# EAGLE design Qwiic_Accelerometer_LIS2DH12 (EAGLE 9.4.2)
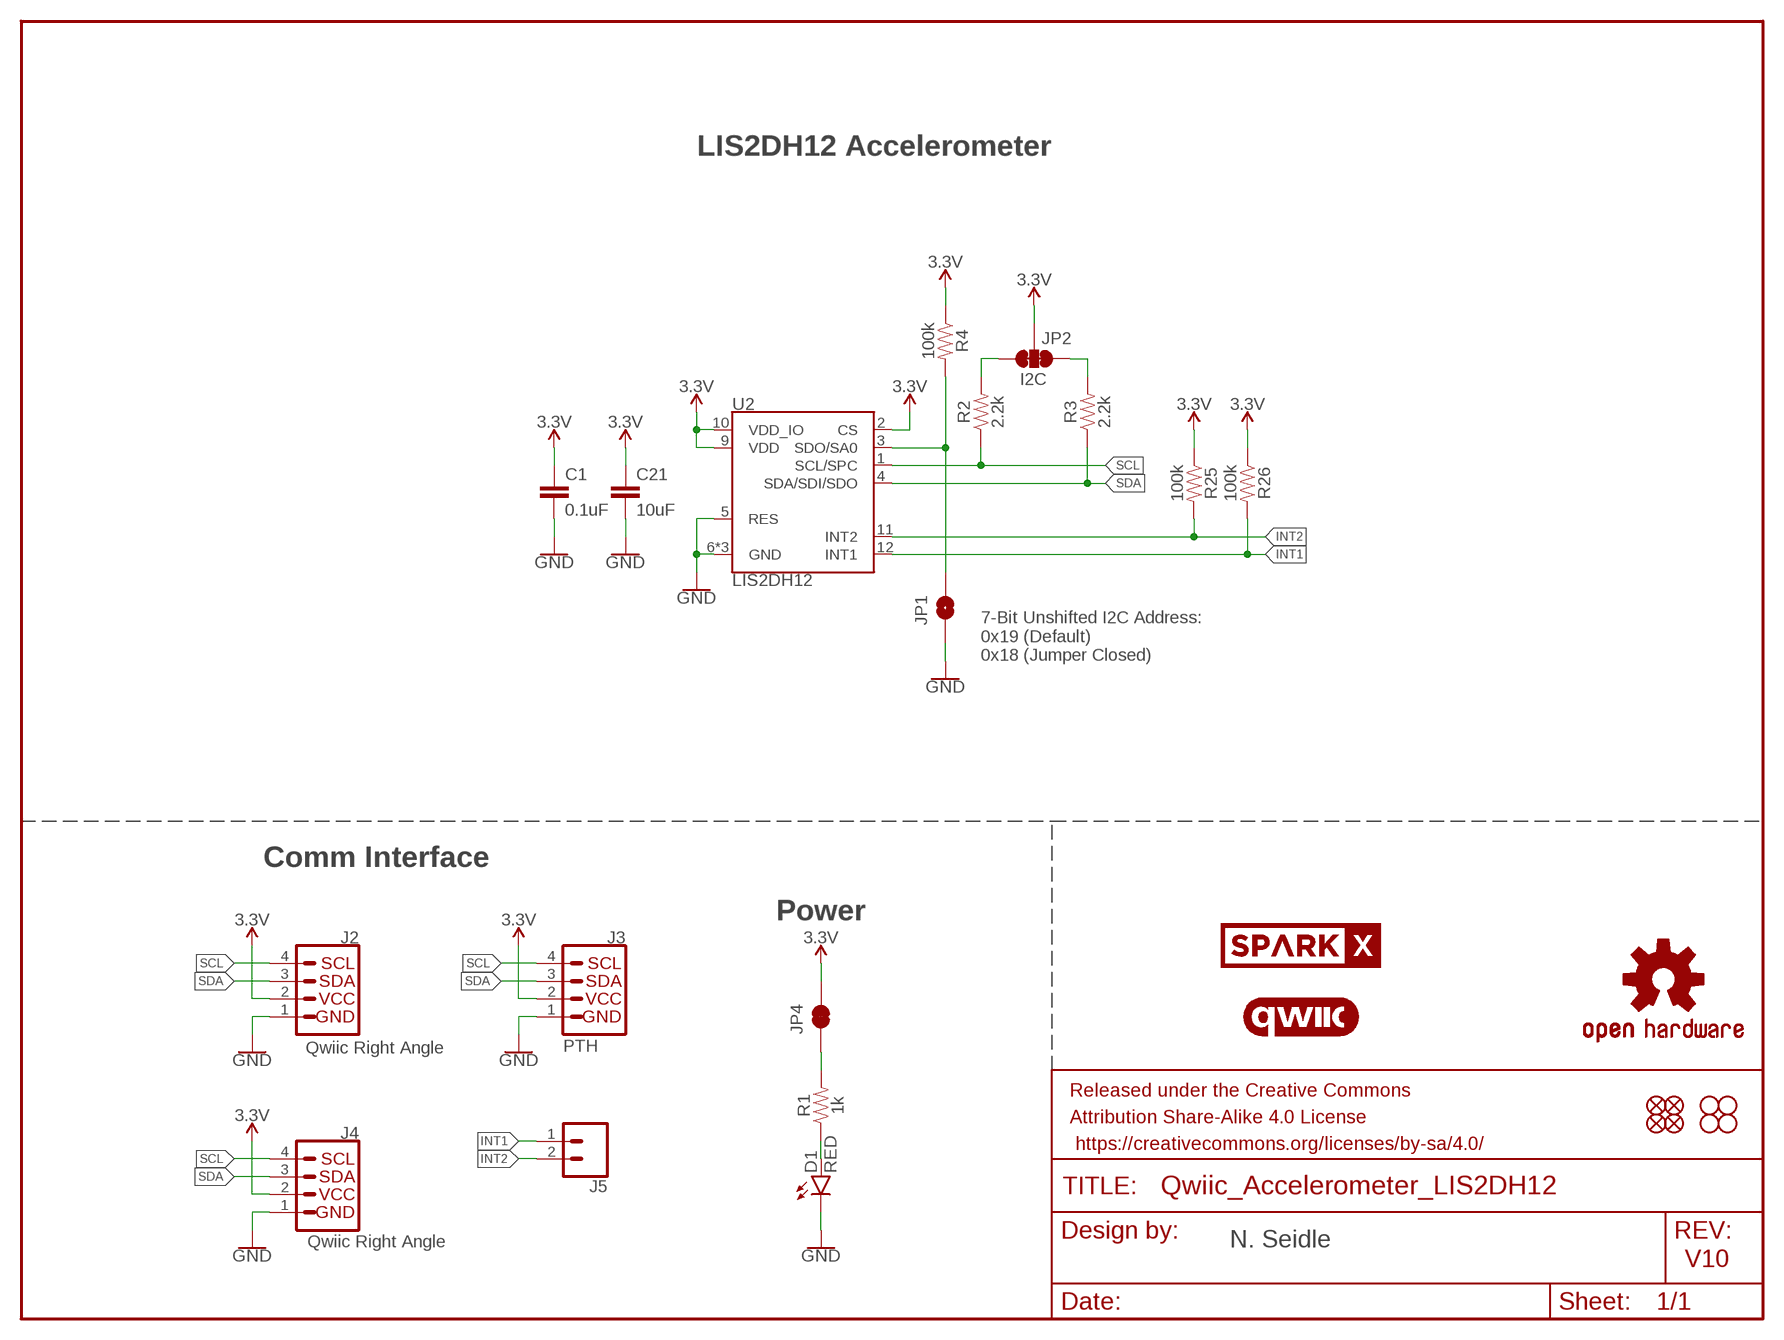
[diagram p0: schematic, sheet 1]

## Parts
C1  0.1uF  0.1UF-0603-25V-(+80/-20%)  [0603]
C21  10uF  10UF-0603-6.3V-20%  [0603]
D1  RED  LED-RED0603  [LED-0603]
FD1  FIDUCIALUFIDUCIAL  [FIDUCIAL-MICRO]
FD2  FIDUCIALUFIDUCIAL  [FIDUCIAL-MICRO]
FD3  FIDUCIALUFIDUCIAL  [FIDUCIAL-MICRO]
FD4  FIDUCIALUFIDUCIAL  [FIDUCIAL-MICRO]
FRAME1  FRAME-LETTER  [CREATIVE_COMMONS]
H1  STAND-OFF  [STAND-OFF]
H2  STAND-OFF  [STAND-OFF]
H3  STAND-OFF  [STAND-OFF]
H4  STAND-OFF  [STAND-OFF]
J2  Qwiic Right Angle  I2C_STANDARDQWIIC  [JST04_1MM_RA]
J3  PTH  I2C_STANDARD_NO_SILK  [1X04_NO_SILK]
J4  Qwiic Right Angle  I2C_STANDARDQWIIC  [JST04_1MM_RA]
J5  CONN_021X02_NO_SILK  [1X02_NO_SILK]
JP1  JUMPER-SMT_2_NO_SILK  [SMT-JUMPER_2_NO_SILK]
JP2  I2C  JUMPER-SMT_3_2-NC_TRACE_SILK  [SMT-JUMPER_3_2-NC_TRACE_SILK]
JP4  JUMPER-SMT_2_NC_TRACE_SILK  [SMT-JUMPER_2_NC_TRACE_SILK]
LOGO1  OSHW-LOGOMINI  [OSHW-LOGO-MINI]
LOGO4  QWIIC_LOGO_CONNECTOR  [QWIIC_5.5MM]
R1  1k  1KOHM-0603-1/10W-1%  [0603]
R2  2.2k  2.2KOHM-0603-1/10W-1%  [0603]
R3  2.2k  2.2KOHM-0603-1/10W-1%  [0603]
R4  100k  100KOHM-0603-1/10W-1%  [0603]
R25  100k  100KOHM-0603-1/10W-1%  [0603]
R26  100k  100KOHM-0603-1/10W-1%  [0603]
U2  LIS2DH12  [LGA-12-LISDH12]
U$30  SPARKX-LOGO4  [SPARKX-MEDIUM]

## Nets
3.3V: C1.1 C21.1 J2.2 J3.2 J4.2 JP2.2 JP4.2 R4.1 R25.1 R26.1 U2.2(CS) U2.9(VDD) U2.10(VDD_IO)
GND: C1.2 C21.2 D1.C J2.1 J3.1 J4.1 JP1.1 U2.5(RES) U2.6(GND) U2.7(GND) U2.8(GND)
INT1: J5.1 R26.2 U2.12(INT1)
INT2: J5.2 R25.2 U2.11(INT2)
N$1: JP4.1 R1.2
N$2: JP2.1 R3.2
N$3: JP2.3 R2.2
N$4: JP1.2 R4.2 U2.3(SDO/SA0)
N$10: D1.A R1.1
SCL: J2.4 J3.4 J4.4 R2.1 U2.1(SCL/SPC)
SDA: J2.3 J3.3 J4.3 R3.1 U2.4(SDA/SDI/SDO)

## Notes on the sheet
- LIS2DH12 Accelerometer
- 7-Bit Unshifted I2C Address:
  0x19 (Default)
  0x18 (Jumper Closed)
- Comm Interface
- Power
- N. Seidle
- V10

## Library data of the parts
C1 = SparkFun-Capacitors:0.1UF: 0.1µF ceramic capacitors A capacitor is a passive two-terminal electrical component used to store electrical energy temporarily in an electric field.; PROD_ID: CAP-00810
C21 = SparkFun-Capacitors:10UF: 10.0µF ceramic capacitors A capacitor is a passive two-terminal electrical component used to store electrical energy temporarily in an electric field.; PROD_ID: CAP-11015
D1 = SparkFun-LED:LED-RED: Red SMD LED Used in manufacturing of most products at SparkFun Packages: 0603 - SMD 0603 package [Product Link] <http://docs.avagotech.com/docs/AV02-0551EN> 0603 SMART - SMD 0603 SMART package ( more efficient and expensive)[Product Link] <http://www.osram-os.com/Graphics/XPic2/00077099_0.pdf> 1206 - SMD1206 package [Product Link] <https://www.sparkfun.com/datasheets/DevTools/LilyPad/Q150OVS4.pdff> SparkFun Products: Pro Mini 328 -5V <https://www.sparkfun.com/products/821> RedBoard <https://www.sparkfun.com/products/12757> IOIO-OTG <https://www.sparkfun.com/products/13613>; PROD_ID: DIO-00819
FD1-FD4 = SparkFun-Aesthetics:FIDUCIAL: Fiducial Alignment Points Point-of-reference for pick-and-place machines and other optical instruments.
FRAME1 = SparkFun-Aesthetics:FRAME-LETTER: Schematic Frame - Letter Standard 8.5x11 US Letter frame
H1-H4 = SparkFun-Hardware:STAND-OFF: Stand Off Drill holes for mechanically mounting via screws, standoffs, etc. Note: Use the keepout ring to avoid running the screw head into surrounding components. Variant Overviews STAND-OFF - Mechanical footprint for a #4 phillips button head screw. STAND-OFF-TIGHT - Mechanical footprint for a #4 phillips button head screw, Example SparkFun Products Screw - Phillips Head (1/4", 4-40, 10 pack) <https://www.sparkfun.com/products/10453> (PRT-10453) Screw - Phillips Head (1/2", 4-40, 10 pack) <https://www.sparkfun.com/products/10452> (PRT-10452) Screw - Phillips Head (3/4", 4-40, 10 pack) <https://www.sparkfun.com/products/10451> (PRT-10451) Screw - Phillips Head (1", 4-40, 10 pack) <https://www.sparkfun.com/products/10450> (PRT-10450)
J2 J4 = SparkFun-Connectors:I2C_STANDARD: SparkFun I2C Standard Pinout Header SparkFun has standardized on a pinout for all I2C based sensor breakouts. This pinout allows I2C boards to be plugged directly into the headers on Arduino Uno compatible boards, and to be daisy chained easily. Example SparkFun Products: SparkFun Atmospheric Sensor Breakout - BME280 <https://www.sparkfun.com/products/13676> SparkFun Altitude/Pressure Sensor Breakout - MPL3115A2 <https://www.sparkfun.com/products/11084> SparkFun TOF Range Finder Sensor - VL6180 <https://www.sparkfun.com/products/12785>; PROD_ID: CONN-13694
J3 = SparkFun-Connectors:I2C_STANDARD: SparkFun I2C Standard Pinout Header SparkFun has standardized on a pinout for all I2C based sensor breakouts. This pinout allows I2C boards to be plugged directly into the headers on Arduino Uno compatible boards, and to be daisy chained easily. Example SparkFun Products: SparkFun Atmospheric Sensor Breakout - BME280 <https://www.sparkfun.com/products/13676> SparkFun Altitude/Pressure Sensor Breakout - MPL3115A2 <https://www.sparkfun.com/products/11084> SparkFun TOF Range Finder Sensor - VL6180 <https://www.sparkfun.com/products/12785>
J5 = SparkFun-Connectors:CONN_02: Multi connection point. Often used as Generic Header-pin footprint for 0.1 inch spaced/style header connections On any of the 0.1 inch spaced packages, you can populate with these: Break Away Headers - Straight <https://www.sparkfun.com/products/116> (PRT-00116) Break Away Male Headers - Right Angle <https://www.sparkfun.com/products/553> (PRT-00553) Female Headers <https://www.sparkfun.com/products/115> (PRT-00115) Break Away Headers - Machine Pin <https://www.sparkfun.com/products/117> (PRT-00117) Break Away Female Headers - Swiss Machine Pin <https://www.sparkfun.com/products/743> (PRT-00743) For SCREWTERMINALS and SPRING TERMINALS visit here: Screw Terimnals on SparkFun.com <https://www.sparkfun.com/search/results?term=Screw+Terminals> (5mm/3.5mm/2.54mm spacing) This device is also useful as a general connection point to wire up your design to another part of your project. Our various solder wires solder well into these plated through hole pads. Hook-Up Wire - Assortment (Stranded, 22 AWG) <https://www.sparkfun.com/products/11375> (PRT-11375) Hook-Up Wire - Assortment (Solid Core, 22 AWG) <https://www.sparkfun.com/products/11367> (PRT-11367) View the entire wire category on our website here <https://www.sparkfun.com/categories/141> Special notes: Molex polarized connector foot print use with: PRT-08233 with associated crimp pins and housings. 2.54_SCREWTERM for use with PRT-10571. 3.5mm Screw Terminal footprints for PRT-08084 5mm Screw Terminal footprints for use with PRT-08432
JP1 = SparkFun-Jumpers:JUMPER-SMT_2_NO: Normally open jumper This jumper has two pads in close proximity to each other. Apply solder to close the connection. Round pads are easier to solder for beginners, but are a lot larger. SparkFun Product that uses the round pads: SparkFun EL Sequencer <https://www.sparkfun.com/products/12781>
JP2 = SparkFun-Jumpers:JUMPER-SMT_3_2-NC_TRACE: Normally closed trace jumper (2 of 2 connections) This jumper has a trace between all three pads so they are normally closed (NC). Use a razor knife to open the connection(s). For best results follow the IPC guidelines for cutting traces: Cutout at least 0.063 mm (0.005 in). Remove all loose material to clean up the cut area. Seal the cut with an approved epoxy. Reapply solder to reclose the connection(s).
JP4 = SparkFun-Jumpers:JUMPER-SMT_2_NC_TRACE: Normally closed trace jumper This jumper has a trace between two pads so it's normally closed (NC). Use a razor knife to open the connection. For best results follow the IPC guidelines for cutting traces: Cutout at least 0.063 mm (0.005 in). Remove all loose material to clean up the cut area. Seal the cut with an approved epoxy. Reapply solder to reclose the connection.
LOGO1 = SparkFun-Aesthetics:OSHW-LOGO: Open-Source Hardware (OSHW) Logo This logo indicates the piece of hardware it is found on incorporates a OSHW license and/or adheres to the definition of open source hardware found here: http://freedomdefined.org/OSHW
LOGO4 = SparkFun-Aesthetics:QWIIC_LOGO: Qwiic Logos for placement on schematic and PCB. The 5.5mm silk logo is best for placing next to Qwiic connector.
R1 = SparkFun-Resistors:1KOHM: 1kΩ resistor A resistor is a passive two-terminal electrical component that implements electrical resistance as a circuit element. Resistors act to reduce current flow, and, at the same time, act to lower voltage levels within circuits. - Wikipedia; PROD_ID: RES-07856
R2 R3 = SparkFun-Resistors:2.2KOHM: 2.2kΩ resistor A resistor is a passive two-terminal electrical component that implements electrical resistance as a circuit element. Resistors act to reduce current flow, and, at the same time, act to lower voltage levels within circuits. - Wikipedia; PROD_ID: RES-08272
R4 R25 R26 = SparkFun-Resistors:100KOHM: 100kΩ resistor A resistor is a passive two-terminal electrical component that implements electrical resistance as a circuit element. Resistors act to reduce current flow, and, at the same time, act to lower voltage levels within circuits. - Wikipedia; PROD_ID: RES-07828
U2 = SparkFun-Sensors:LIS2DH12; DIGIKEY: 497-14851-2-ND; PROD_ID: IC-14229
U$30 = SparkX:SPARKX-LOGO

## Board
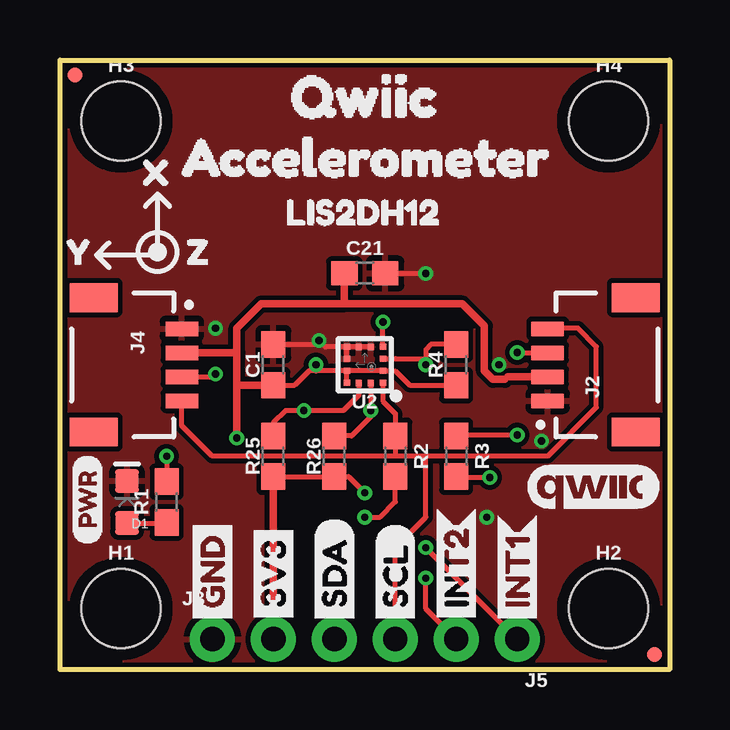
[diagram p1: board, top side]
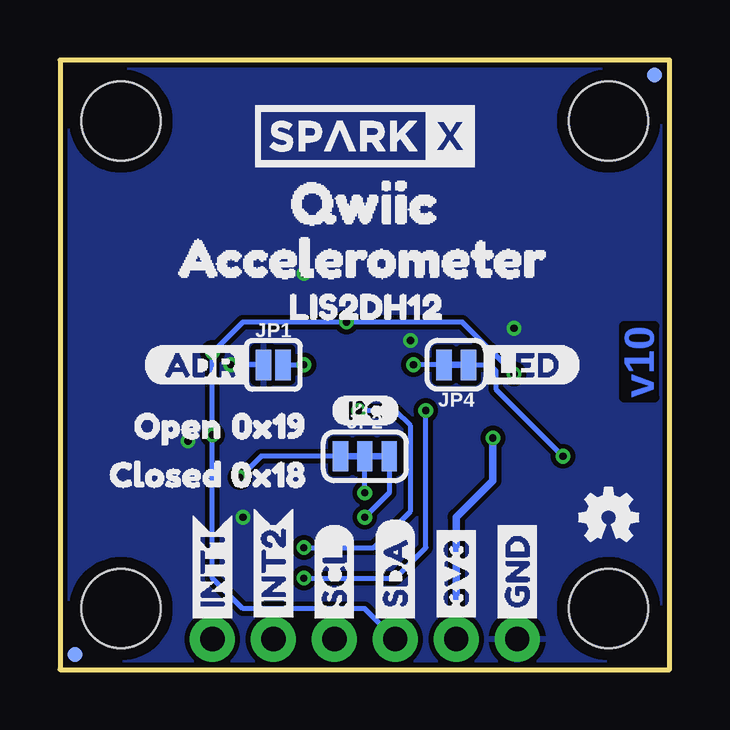
[diagram p2: board, bottom side, seen from below]

Size 25.4 x 25.4 mm. Coordinates in mm from the lower left corner, seen from the top.
Outline: 25.4,0 0,0 0,25.4 25.4,25.4 25.4,0
Copper layers (1*16): Top 0.035mm / dielectric 1.5mm / Bottom 0.035mm
Design rules "SparkFun-2-layer-PCBWay-LIMIT": minimum track width 6mil, minimum drill 0.3mm, track to track 6mil, track to pad 6mil, pad to pad 6mil, via to via 6mil, smd to smd 6mil, copper to edge 6mil, drill to drill 6mil, minimum pad ring 6mil, minimum via ring 6mil, stop-mask expansion 4mil, vias tented up to drill 25mil, thermal gap 10mil

### Footprints (pad centres in the part's own frame; a part is rotated, then mirrored left to right if it is on the bottom)
0603 = smd 1.1 x 1: 1 -0.85,0; 2 0.85,0
LED-0603 = smd 1 x 1: A -0.877,0; C 0.877,0
FIDUCIAL-MICRO = smd 0.635 x 0.635: 1 0,0
STAND-OFF = hole 3.302: 0,0
JST04_1MM_RA = smd 0.6 x 1.35: 1 -1.5,0; 2 -0.5,0; 3 0.5,0; 4 1.5,0 | smd 1.2 x 2: NC1 2.8,-3.675; NC2 -2.8,-3.675
1X04_NO_SILK = drill 1.016 pad 1.88: 1 0,0; 2 2.54,0; 3 5.08,0; 4 7.62,0
1X02_NO_SILK = drill 1.016 pad 1.88: 1 0,0; 2 2.54,0
SMT-JUMPER_2_NO_SILK = smd 0.635 x 1.27: 1 -0.406,0; 2 0.406,0
SMT-JUMPER_3_2-NC_TRACE_SILK = smd 0.635 x 1.27: 1 -1.016,0; 2 0,0; 3 1.016,0
SMT-JUMPER_2_NC_TRACE_SILK = smd 0.635 x 1.27: 1 -0.508,0; 2 0.508,0
LGA-12-LISDH12 = smd 0.275 x 0.25: 1 -0.75,0.75; 2 -0.75,0.25; 3 -0.75,-0.25; 4 -0.75,-0.75; 7 0.75,-0.75; 8 0.75,-0.25; 9 0.75,0.25; 10 0.75,0.75 | smd 0.25 x 0.275: 5 -0.25,-0.75; 6 0.25,-0.75; 11 0.25,0.75; 12 -0.25,0.75

### Placement (x,y rotation side)
C1  8.89,12.7 90 top
C21  12.7,16.51 0 top
D1  2.79,6.99 90 top
FD1  0.64,24.77 0 top
FD2  24.77,0.64 0 top
FD3  24.77,0.64 0 bottom
FD4  0.64,24.77 0 bottom
FRAME1  -17.78,-17.78 0 top  (outside the outline)
H1  2.54,2.54 0 top
H2  22.86,2.54 0 top
H3  2.54,22.86 0 top
H4  22.86,22.86 0 top
J2  20.32,12.7 90 top
J3  6.35,1.27 0 top
J4  5.08,12.7 270 top
J5  19.05,1.27 180 top
JP1  16.51,12.7 0 bottom
JP2  12.7,8.89 0 bottom
JP4  8.89,12.7 180 bottom
LOGO1  2.54,6.35 0 bottom
LOGO4  22.23,7.62 0 top
R1  4.45,6.99 90 top
R2  13.97,8.89 270 top
R3  16.51,8.89 270 top
R4  16.51,12.7 90 top
R25  8.89,8.89 90 top
R26  11.43,8.89 90 top
U2  12.7,12.7 180 top
U$1  [SDA-[)]  11.43,1.65 90 top
U$2  [X0]  2.54,20.7 0 top
U$3  [SCL-[)]  13.97,1.65 90 top
U$4  [SDA-[)]  11.43,1.65 90 bottom
U$5  [SCL-[)]  13.97,1.65 90 bottom
U$6  [3V3-04]  8.89,1.65 90 top
U$7  [3V3-04]  8.89,1.65 90 bottom
U$8  [GND-04]  6.35,1.65 90 top
U$9  [GND-04]  6.35,1.65 90 bottom
U$10  [ACCELEROMETER2]  3.68,21.34 0 top
U$11  [INT13]  19.05,1.65 90 top
U$12  [INT13]  19.05,1.65 90 bottom
U$13  [INT24]  16.51,1.65 90 top
U$14  [QWIIC2]  17.27,19.43 0 bottom
U$15  [INT24]  16.51,1.65 90 bottom
U$16  [0X183]  19.18,8.13 0 bottom
U$17  [LIS2DH120]  8.51,19.05 0 top
U$18  [PWR-()-03]  1.14,5.21 90 top
U$19  [I_SUPER2_C-()-03]  14.1,10.79 0 bottom
U$20  [Y1]  -0.64,17.4 0 top
U$21  [Z2]  4.19,17.4 0 top
U$22  [QWIIC2]  8.13,23.88 0 top
U$23  [0X192]  19.18,10.16 0 bottom
U$24  [ADR1]  21.97,12.7 0 bottom
U$25  [CLOSED4]  24.26,8.13 0 bottom
U$26  [OPEN5]  23.24,10.16 0 bottom
U$27  [ACCELEROMETER2]  21.84,17.14 0 bottom
U$28  [LIS2DH120]  16.76,15.11 0 bottom
U$29  [LED7]  8.26,12.7 0 bottom
U$30  12.7,22.23 0 bottom

### Tracks (layer width: path | path; a pad name or v marks a point on that pad's centre or on a via)
3.3V  (via drill 0.3)
  Top 0.203: R4.1 14.57,11.85 13.97,12.45 U2.2 U2.9 | U2.10 U2.9 | C1.1 9.78,11.85 10.38,12.45 10.67,12.45 | R25.1 R26.1 12.03,8.04 v12.7,7.37 | U2.9 10.67,12.45 | v10.67,12.7 10.67,12.45
  Top 0.305: 11.81,15.24 8.38,15.24 7.37,14.22 7.37,13.21 | 11.81,15.24 16.76,15.24 17.68,14.33 17.68,12.45 18.04,12.09 18.54,12.09 18.65,12.2 J2.2 | C21.1 11.85,15.28 11.81,15.24 | 7.37,11.94 7.37,13.21 | 7.37,13.21 7.36,13.2 J4.2 | J3.2 R25.1 | 7.37,11.94 v7.37,9.65 | 7.37,11.94 7.45,11.85 C1.1
  Bottom 0.203: v12.7,7.37 JP2.2 | JP4.2 v10.67,12.7
  Bottom 0.305: v7.37,9.65 7.37,7.87 8.89,6.35 J3.2
GND  (via drill 0.3)
  Top 0.203: C21.2 v15.24,16.51 | C1.2 10.63,13.55 v10.79,13.72 11.06,13.45 U2.7 | U2.5 U2.6 U2.7 | U2.8 U2.7 | J2.1 19.79,11.2
  Bottom 0.203: JP1.1 v18.29,12.7
  other vias: 6.48,14.22 20.07,9.53 17.78,6.35
  pour Top (isolate 0.203, rank 4): 0,0 0,25.4 25.4,25.4 25.4,0
  pour Bottom (isolate 0.203, rank 4): 0,0 0,25.4 25.4,25.4 25.4,0
INT1  (via drill 0.3)
  Top 0.203: U2.12 v12.95,10.79 12.95,10.54 12.15,9.74 R26.2 | J5.1 v15.24,5.08
  Bottom 0.203: v15.24,5.08 12.32,5.08 10.79,6.6 10.79,10.16 11.43,10.79 v12.95,10.79
INT2  (via drill 0.3)
  Top 0.203: U2.11 12.45,11.43 11.81,10.79 v10.16,10.79 9.4,10.79 8.89,10.29 R25.2 | J5.2 15.24,2.54 v15.24,3.81
  Bottom 0.203: v15.24,3.81 11.43,3.81 10.16,5.08 v10.16,10.79
N$1  (via drill 0.3)
  Top 0.203: v4.45,8.89 R1.2
  Bottom 0.203: JP4.1 7.49,12.7 7.24,12.45 7.24,11.68 v4.45,8.89
N$2  (via drill 0.3)
  Top 0.203: v17.91,8 16.55,8 R3.2
  Bottom 0.203: JP2.1 17.02,8.89 v17.91,8
N$3  (via drill 0.3)
  Top 0.203: v12.7,6.35 13.34,6.35 13.97,6.99 R2.2
  Bottom 0.203: JP2.3 11.68,7.37 v12.7,6.35
N$4  (via drill 0.3)
  Top 0.203: U2.3 13.97,12.95 15.24,12.95 | R4.2 15.46,13.55 15.24,13.34 15.24,12.95 | 15.24,12.95 v15.24,12.7
  Bottom 0.203: JP1.2 v15.24,12.7
N$10
  Top 0.203: D1.A 4.42,6.11 R1.1
SCL
  Top 0.203: U2.1 13.45,11.19 13.97,10.67 R2.1 13.97,8.89 | J4.4 5.08,10.16 6.35,8.89 13.97,8.89 | 15.24,8.89 20.32,8.89 22.35,10.92 22.35,13.46 21.59,14.22 20.34,14.22 J2.4 | 15.24,8.89 13.97,8.89 | J3.4 13.97,5.08 15.24,6.35 15.24,8.89
SDA  (via drill 0.3)
  Top 0.203: J4.3 6.36,12.2 v6.48,12.32 | U2.4 13.45,14.47 v13.46,14.48 | R3.1 16.55,9.78 v19.05,9.78 | v19.05,13.21 J2.3
  Bottom 0.203: v6.48,12.32 8.64,14.48 v13.46,14.48 17.78,14.48 v19.05,13.21 v19.05,9.78 19.05,3.81 17.78,2.54 12.7,2.54 J3.3

### Text on the board
Bottom: v10
Measures: Units in inches
tDocu: N. Seidle